# Altium schematic sheet MCU.SchDoc
size B
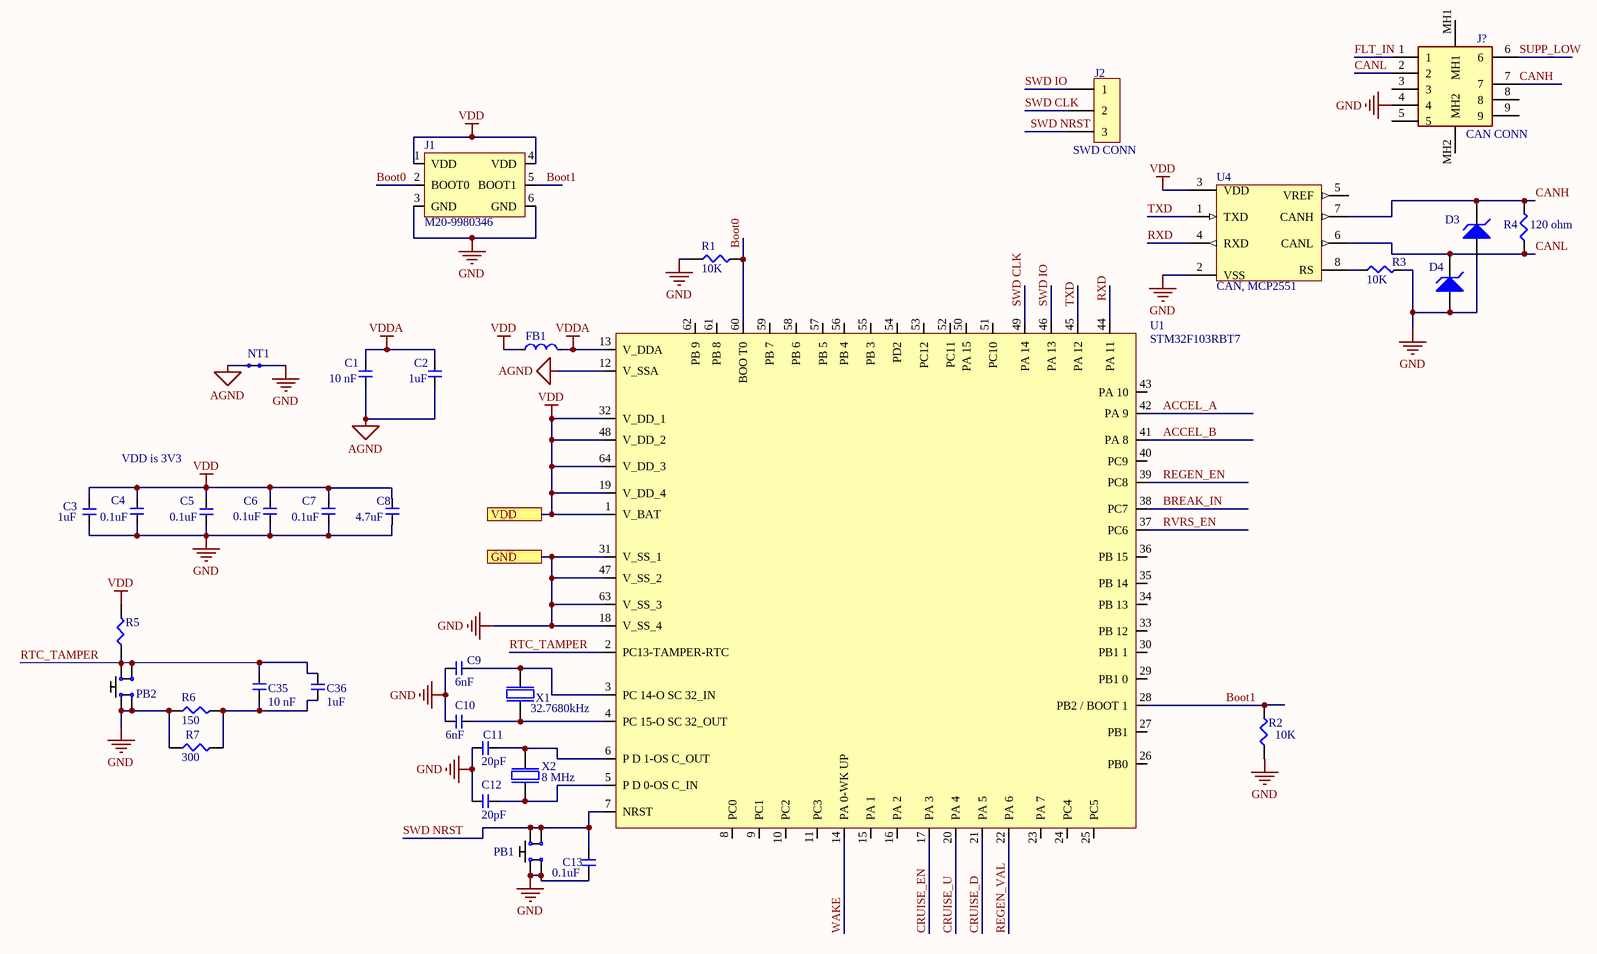
[diagram p0: MCU.SchDoc]

## Parts
C1  10 nF  [C0805]
C2  1uF  [C0805]
C3  1uF  [C0805]
C4  0.1uF  [C0805]
C5  0.1uF  [C0805]
C6  0.1uF  [C0805]
C7  0.1uF  [C0805]
C8  4.7uF  [C0805]
C9  6nF  [C0805]
C10  6nF  [C0805]
C11  20pF  [C0805]
C12  20pF  [C0805]
C13  0.1uF  [C0805]
C35  10 nF  [C0805]
C36  1uF  [C0805]
D3  TVS Diode 5V  [SOD-323]  (value not drawn)
D4  TVS Diode 5V  [SOD-323]  (value not drawn)
FB1  LF1206E152R-10  [L1206]  (value not drawn)
J1  M20-9980346  [M20-9980346]
J2  1x3 HDR100  [MOLEX 0901200763]  (value not drawn)
J?  CAN CONN  [609-1486-ND]
NT1  NET TIE  [NETTIE]  (value not drawn)
PB1  P12961SCT-ND  [P12961SCT-ND]  (value not drawn)
PB2  P12961SCT-ND  [P12961SCT-ND]  (value not drawn)
R1  10K  [R0805]
R2  10K  [R0805]
R3  10K  [R0805]
R4  120 ohm  [L0805]
R5  RC0402JR-074K7L  [R0805]  (value not drawn)
R6  150  [R0805]
R7  300  [R0805]
U1  STM32F103RBT7  [stm32f103rb]
U4  CAN, MCP2551  [LT1677IS8#TRPBF]
X1  32.7680kHz  [MC-306 32.7680K-E5]
X2  8 MHz  [MA-406 8.0000M-G3]

## Ports
GND, VDD

## Nets
AGND: C1.2 C2.1 NT1.0 U1.12(V_SSA)
GND: C3.2 C4.1 C5.2 C6.2 C7.2 C8.1 C9.1 C10.1 C11.1 C12.1 C13.2 D3.1(A) D4.1(A) J1.3(GND) J1.6(GND) J?.4 NT1.1 PB1.1(A) PB1.3(B) PB2.1(A) PB2.3(B) R1.1 R2.1 R3.2 R6.1 R7.1 U1.18(V_SS_4) U1.31(V_SS_1) U1.47(V_SS_2) U1.63(V_SS_3) U4.2(VSS) ; port GND
VDD: C3.1 C4.2 C5.1 C6.1 C7.1 C8.2 FB1.1 J1.1(VDD) J1.4(VDD) R5.2 U1.1(V_BAT) U1.19(V_DD_4) U1.32(V_DD_1) U1.48(V_DD_2) U1.64(V_DD_3) U4.3(VDD) ; port VDD
VDDA: C1.1 C2.2 FB1.2 U1.13(V_DDA)
ACCEL_A: U1.42(PA_9)
ACCEL_B: U1.41(PA_8)
Boot0: J1.2(BOOT0) R1.2 U1.60(BOO_T0)
Boot1: J1.5(BOOT1) R2.2 U1.28(PB2_/_BOOT_1)
BREAK_IN: U1.38(PC7)
CANH: D3.2(K) J?.7 R4.2 U4.7(CANH)
CANL: D4.2(K) J?.2 R4.1 U4.6(CANL)
CRUISE_D: U1.21(PA_5)
CRUISE_EN: U1.17(PA_3)
CRUISE_U: U1.20(PA_4)
FLT_IN: J?.1
REGEN_EN: U1.39(PC8)
REGEN_VAL: U1.22(PA_6)
RTC_TAMPER: C35.2 C36.2 PB2.2(A') PB2.4(B') R5.1 U1.2(PC13-TAMPER-RTC)
RVRS_EN: U1.37(PC6)
RXD: U1.44(PA_11) U4.4(RXD)
SUPP_LOW: J?.6
SWD CLK: J2.2 U1.49(PA_14)
SWD IO: J2.1 U1.46(PA_13)
SWD NRST: C13.1 J2.3 PB1.2(A') PB1.4(B') U1.7(NRST)
TXD: U1.45(PA_12) U4.1(TXD)
WAKE: U1.14(PA_0-WK_UP)
NetC9_2: C9.2 U1.3(PC_14-O_SC_32_IN) X1.4
NetC10_2: C10.2 U1.4(PC_15-O_SC_32_OUT) X1.1
NetC11_2: C11.2 U1.6(P_D_1-OS_C_OUT) X2.1
NetC12_2: C12.2 U1.5(P_D_0-OS_C_IN) X2.4
NetC35_1: C35.1 C36.1 R6.2 R7.2
NetR3_1: R3.1 U4.8(RS)

Not connected (* = marked no-connect by the designer): J? 3 5 8 9 MH1 MH2; U1 8(PC0) 9(PC1) 10(PC2) 11(PC3) 15(PA_1) 16(PA_2) 23(PA_7) 24(PC4) 25(PC5) 26(PB0) 27(PB1) 29(PB1_0) 30(PB1_1) 33(PB_12) 34(PB_13) 35(PB_14) 36(PB_15) 40(PC9) 43(PA_10) 50(PA_15) 51(PC10) 52(PC11) 53(PC12) 54(PD2) 55(PB_3) 56(PB_4) 57(PB_5) 58(PB_6) 59(PB_7) 61(PB_8) 62(PB_9); U4 5(VREF)

## Notes on the sheet
- (near J2) SWD CONN
- VDD is 3V3

## Library data of the parts
C1 C35 = 399-17617-2-ND: CAP CER .01UF 100V X7R SMD 0805; Manufacturer 1: KEMET; Manufacturer Part Number 1: C0805C103K1RAC7210; Dielectric Material: Ceramic; Tolerance: 10%; Capacitance: 10nF; Supplier 1: Digi-Key; Stock 1: 57741; Pricing 1: 1=0.10000, 10=0.06800, 100=0.03040, 500=0.02172, 1000=0.01706, 2500=0.01551, 5000=0.01427 (USD); RoHS: Yes; Mount: Surface Mount; Case/Package: 0805; Case Code (Imperial): 0805; Case Code (Metric): 2012; Min Operating Temperature: -55°C; Max Operating Temperature: 125°C; Packaging: Tape and Reel; Package Quantity: 10000; Voltage Rating: 100V; Voltage Rating (DC): 100V; Dielectric: X7R; Termination: SMD/SMT; Length: 2mm; Height: 0.78mm; Depth: 1.25mm; Radiation Hardening: No; ComponentLink1URL: http://components.arrow.com/part/dataview/0323_00324583?src-supplier=Arrow+Europe; ComponentLink1Description: http://components.arrow.com/part/dataview/0323_00324583?src-supplier=Arrow+Europe; ComponentLink2URL: http://www.mouser.com/ds/2/212/KEM_C1002_X7R_SMD-1102033.pdf?src-supplier=Mouser; ComponentLink2Description: http://www.mouser.com/ds/2/212/KEM_C1002_X7R_SMD-1102033.pdf?src-supplier=Mouser; ComponentLink3URL: http://components.arrow.com/part/dataview/2091052S6675795N7429?src-supplier=Arrow; ComponentLink3Description: http://components.arrow.com/part/dataview/2091052S6675795N7429?src-supplier=Arrow; ComponentLink4URL: https://www.verical.com/server-webapp/html/getDatasheet?partID=131027&src-supplier=Verical; ComponentLink4Description: https://www.verical.com/server-webapp/html/getDatasheet?partID=131027&src-supplier=Verical; ComponentLink5URL: http://www.kemet.com/kemet/web/homepage/kechome.nsf/weben/C4DA2DA1D1C9D3C3CA2570A50016092D/$file/KEM_C1002_X7R_SMD.pdf?src-supplier=Avnet+Europe; ComponentLink5Description: http://www.kemet.com/kemet/web/homepage/kechome.nsf/weben/C4DA2DA1D1C9D3C3CA2570A50016092D/$file/KEM_C1002_X7R_SMD.pdf?src-supplier=Avnet+Europe; ComponentLink6URL: http://www.kemet.com/kemet/web/homepage/kechome.nsf/weben/C4DA2DA1D1C9D3C3CA2570A50016092D/$file/KEM_C1002_X7R_SMD.pdf?src-supplier=Avnet; ComponentLink6Description: http://www.kemet.com/kemet/web/homepage/kechome.nsf/weben/C4DA2DA1D1C9D3C3CA2570A50016092D/$file/KEM_C1002_X7R_SMD.pdf?src-supplier=Avnet; ComponentLink7URL: https://api.kemet.com/component-edge/download/datasheet/C0805C103K1RAC7210.pdf?src-supplier=Digi-Key; ComponentLink7Description: https://api.kemet.com/component-edge/download/datasheet/C0805C103K1RAC7210.pdf?src-supplier=Digi-Key; Supplier Part Number 1: 399-17617-1-ND
C2 C3 C36 = CL21B105KAFNNNE: Cap Ceramic 1uF 25V X7R 10% SMD 0805 125C T/R; Manufacturer: Samsung; Supplier 1: Digi-Key; Supplier Part Number 1: 1276-1066-1-ND; Manufacturer Part Number: CL21B105KAFNNNE; Stock 1: 1606570; Pricing 1: 1 = 0.10000, 10 = 0.07600, 100 = 0.03380, 500 = 0.02416, 1000 = 0.01898 (USD); RoHS: Yes; Mount: Surface Mount; Case/Package: 0805; Contact Plating: Tin; Case Code (Metric): 2012; Case Code (Imperial): 0805; Min Operating Temperature: -55°C; Max Operating Temperature: 125°C; Packaging: Tape and Reel; Package Quantity: 1; Capacitance: 1uF; Tolerance: 10%; Voltage Rating: 25V; Dielectric: X7R; Voltage: 25V; Voltage Rating (DC): 25V; Length: 2mm; Height: 1.25mm; Depth: 1.25mm; Width: 0.049inch; Thickness: 0.053inch; Radiation Hardening: No; Lead Free: Lead Free; ComponentLink1URL: https://datasheet.ciiva.com/25800/cl21b105kafnnne-25800163.pdf?src-supplier=Digi-Key; ComponentLink1Description: https://datasheet.ciiva.com/25800/cl21b105kafnnne-25800163.pdf?src-supplier=Digi-Key; ComponentLink2URL: https://datasheet.ciiva.com/15195/getdatasheetpartid-355205-15195880.pdf?src-supplier=Verical; ComponentLink2Description: https://datasheet.ciiva.com/15195/getdatasheetpartid-355205-15195880.pdf?src-supplier=Verical; Category: Capacitors
C4-C7 C13 = CL21B104KBCWPNC: CAP CER 0.1UF 50V X7R 0805; Manufacturer: Samsung; Capacitance: 100nF; Tolerance: 10%; Supplier 1: Digi-Key; Supplier Part Number 1: 1276-6557-1-ND; Manufacturer Part Number: CL21B104KBCWPNC; Stock 1: 6545; Pricing 1: 1 = 0.10000, 10 = 0.06700, 100 = 0.02990, 500 = 0.02138, 1000 = 0.01680 (USD); RoHS: Yes; Mount: Surface Mount; Case/Package: 0805; Case Code (Metric): 2012; Case Code (Imperial): 0805; Min Operating Temperature: -55°C; Max Operating Temperature: 125°C; Packaging: Tape and Reel; Voltage Rating: 50V; Features: Soft Termination; Length: 0.079inch; Width: 0.049inch; Thickness: 0.053inch; Ratings: AEC-Q200; Category: Capacitors
C8 = 311-1371-2-ND: CAP CER 4.7UF 10V Y5V 0805; Manufacturer 1: Yageo; Manufacturer Part Number 1: CC0805ZRY5V6BB475; Tolerance: 80%; Supplier 1: Digi-Key; Stock 1: 117585; Pricing 1: 1=0.19000, 10=0.13200, 100=0.06670, 500=0.04564, 1000=0.04037 (USD); RoHS: Yes; Mount: Surface Mount; Case/Package: 0805; Number of Pins: 2; Case Code (Metric): 2012; Case Code (Imperial): 0805; Min Operating Temperature: -30°C; Max Operating Temperature: 85°C; Package Quantity: 1; Capacitance: 4.7uF; Voltage Rating: 10V; Packaging: Tape and Reel; Voltage Rating (DC): 10V; Dielectric: Y5V; Termination: SMD/SMT; Composition: Ceramic; Length: 2mm; Height: 0.85mm; Width: 0.049inch; Thickness: 0.033inch; Depth: 1.25mm; Radiation Hardening: No; REACH SVHC: Unknown; Lead Free: Lead Free; Halogen Free: Halogen Free; ComponentLink1URL: https://datasheet.ciiva.com/26863/getdatasheetpartid-251807-26863009.pdf?src-supplier=Verical; ComponentLink1Description: https://datasheet.ciiva.com/26863/getdatasheetpartid-251807-26863009.pdf?src-supplier=Verical; ComponentLink2URL: https://datasheet.ciiva.com/144/mlccorderingcode-144864.pdf?src-supplier=Digi-Key; ComponentLink2Description: https://datasheet.ciiva.com/144/mlccorderingcode-144864.pdf?src-supplier=Digi-Key; ComponentLink3URL: https://datasheet.ciiva.com/144/mlccorderingcode-144865.pdf?src-supplier=Digi-Key; ComponentLink3Description: https://datasheet.ciiva.com/144/mlccorderingcode-144865.pdf?src-supplier=Digi-Key; ComponentLink4URL: https://datasheet.ciiva.com/11465/upy-gphc-y5v-6-3v-to-50v-5-11465845.pdf?src-supplier=Avnet; ComponentLink4Description: https://datasheet.ciiva.com/11465/upy-gphc-y5v-6-3v-to-50v-5-11465845.pdf?src-supplier=Avnet; ComponentLink5URL: https://datasheet.ciiva.com/16624/upy-gphc-y5v-6-3v-to-50v-5-16624679.pdf?src-supplier=Avnet+Europe; ComponentLink5Description: https://datasheet.ciiva.com/16624/upy-gphc-y5v-6-3v-to-50v-5-16624679.pdf?src-supplier=Avnet+Europe; ComponentLink6URL: https://datasheet.ciiva.com/28450/1132289-28450855.pdf?src-supplier=Element14; ComponentLink6Description: https://datasheet.ciiva.com/28450/1132289-28450855.pdf?src-supplier=Element14; ComponentLink7URL: https://datasheet.ciiva.com/7978/1132289-7978222.pdf?src-supplier=Element14; ComponentLink7Description: https://datasheet.ciiva.com/7978/1132289-7978222.pdf?src-supplier=Element14; ComponentLink8URL: https://datasheet.ciiva.com/144/mlccorderingcode-144863.pdf?src-supplier=Digi-Key; ComponentLink8Description: https://datasheet.ciiva.com/144/mlccorderingcode-144863.pdf?src-supplier=Digi-Key; ComponentLink9URL: https://datasheet.ciiva.com/5425/upy-gp-np0-16v-to-50v-8-5425455.pdf?src-supplier=Mouser; ComponentLink9Description: https://datasheet.ciiva.com/5425/upy-gp-np0-16v-to-50v-8-5425455.pdf?src-supplier=Mouser; ComponentLink10URL: https://datasheet.ciiva.com/17004/upy-gphc-y5v-6-3v-to-50v-5-revised-17004479.pdf?src-supplier=Future+Electronics; ComponentLink10Description: https://datasheet.ciiva.com/17004/upy-gphc-y5v-6-3v-to-50v-5-revised-17004479.pdf?src-supplier=Future+Electronics; Supplier Part Number 1: 311-1371-1-ND
C9 C10 = 478-10411-2-ND: CAP CER 6PF 100V C0G/NP0 0805; Capacitance: 9pF; Dielectric: C0G; Supplier 1: Digi-Key; RoHS: Yes; Mount: Surface Mount; Case/Package: 0805; Weight: 0.000194oz; Case Code (Imperial): 0805; Case Code (Metric): 2012; Min Operating Temperature: -55°C; Max Operating Temperature: 125°C; Packaging: Tape and Reel; Package Quantity: 4000; Voltage Rating: 100V; Voltage Rating (DC): 100V; Termination: SMD/SMT; Length: 2.01mm; Width: 1.25mm; Thickness: 0.037inch; Depth: 1.25mm; Radiation Hardening: No; Supplier Part Number 1: 478-10411-2-ND; ComponentLink1Description: https://www.digikey.com/product-detail/en/avx-corporation/08051A6R0CAT2A/478-10411-2-ND/1601219; ComponentLink1URL: https://www.digikey.com/product-detail/en/avx-corporation/08051A6R0CAT2A/478-10411-2-ND/1601219
C11 C12 = C0805C200J5GACTU: CAP CER 20PF 50V C0G/NP0 0805; Manufacturer: Samsung; Manufacturer Part Number: CL21B103KBANNNC; Material: Ceramic; Capacitance: 10nF; Tolerance: 10%; Dielectric: X7R; Supplier 1: Digi-Key; Supplier Part Number 1: 399-8033-1-ND; RoHS: Yes; Mount: Surface Mount; Case/Package: 0805; Case Code (Metric): 2012; Case Code (Imperial): 0805; Contact Plating: Tin; Min Operating Temperature: -55°C; Max Operating Temperature: 125°C; Packaging: Tape and Reel; Voltage Rating: 50V; Voltage: 50V; Voltage Rating (DC): 50V; Length: 2mm; Height: 0.65mm; Width: 0.049inch; Thickness: 0.03inch; Depth: 1.25mm; Radiation Hardening: No; Lead Free: Lead Free; Category: Capacitors; ComponentLink1Description: https://www.digikey.com/product-detail/en/kemet/C0805C200J5GACTU/399-8033-1-ND/3471756; ComponentLink1URL: https://www.digikey.com/product-detail/en/kemet/C0805C200J5GACTU/399-8033-1-ND/3471756
D3 D4 = SD05T1G: TVS DIODE 5V 9.8V SOD323; Manufacturer: ON Semiconductor; Capacitance: 350pF; Direction: Unidirectional; Clamping Voltage: 14.5V; Peak Pulse Power: 350W; Number of Unidirectional Channels: 1; Min Breakdown Voltage: 6.2V; Power Line Protection: No; Peak Pulse Current: 24A; Element Configuration: Single; Breakdown Voltage: 6.75V; Leakage Current: 10uA; Max Breakdown Voltage: 7.3V; Test Current: 1mA; ESD Protection: Yes; Max Power Dissipation: 200mW; Supplier 1: Digi-Key; Supplier Part Number 1: SD05T1GOSCT-ND; Manufacturer Part Number: SD05T1G; Stock 1: 61559; Pricing 1: 1 = 0.49000, 10 = 0.36500, 100 = 0.20680, 500 = 0.13698, 1000 = 0.10502 (USD); RoHS: Yes; Case/Package: SOD-323-2; Number of Pins: 2; Contact Plating: Tin; Min Operating Temperature: -55°C; Max Operating Temperature: 150°C; Packaging: Tape and Reel; Reverse Standoff Voltage: 5V; Working Voltage: 5V; Composition: Zener; Package Quantity: 1; Operating Supply Voltage: 5V; Max Surge Current: 24A; Number of Elements: 1; Reverse Breakdown Voltage: 6.2V; Polarity: Unidirectional; Termination: SMD/SMT; Power Dissipation: 350W; Max Reverse Leakage Current: 10uA; Voltage Rating (DC): 5V; Max Output Current: 24A; Length: 1.7mm; Height: 1mm; Width: 1.35mm; Depth: 1.25mm; Radiation Hardening: No; Lead Free: Lead Free; REACH SVHC: No SVHC; ComponentLink1URL: https://datasheet.ciiva.com/4507/sd05t1-d-241634-4507873.pdf?src-supplier=Mouser; ComponentLink1Description: https://datasheet.ciiva.com/4507/sd05t1-d-241634-4507873.pdf?src-supplier=Mouser; ComponentLink2URL: https://datasheet.ciiva.com/16200/sd05t1-d-16200994.pdf?src-supplier=Future+Electronics; ComponentLink2Description: https://datasheet.ciiva.com/16200/sd05t1-d-16200994.pdf?src-supplier=Future+Electronics; ComponentLink3URL: https://datasheet.ciiva.com/15143/getdatasheetpartid-117154-15143559.pdf?src-supplier=Verical; ComponentLink3Description: https://datasheet.ciiva.com/15143/getdatasheetpartid-117154-15143559.pdf?src-supplier=Verical; ComponentLink4URL: https://datasheet.ciiva.com/30478/0900766b81250bd7-30478714.pdf?src-supplier=RSComponents; ComponentLink4Description: https://datasheet.ciiva.com/30478/0900766b81250bd7-30478714.pdf?src-supplier=RSComponents; ComponentLink5URL: https://datasheet.ciiva.com/339/sd05t1-d-339830.pdf?src-supplier=Digi-Key; ComponentLink5Description: https://datasheet.ciiva.com/339/sd05t1-d-339830.pdf?src-supplier=Digi-Key; ComponentLink6URL: https://datasheet.ciiva.com/339/sd05t1-d-339831.pdf?src-supplier=Digi-Key; ComponentLink6Description: https://datasheet.ciiva.com/339/sd05t1-d-339831.pdf?src-supplier=Digi-Key; ComponentLink7URL: https://datasheet.ciiva.com/11193/sd05t1-d-11193467.pdf?src-supplier=Avnet; ComponentLink7Description: https://datasheet.ciiva.com/11193/sd05t1-d-11193467.pdf?src-supplier=Avnet; ComponentLink8URL: https://datasheet.ciiva.com/22637/1878253-22637228.pdf?src-supplier=Element14; ComponentLink8Description: https://datasheet.ciiva.com/22637/1878253-22637228.pdf?src-supplier=Element14; ComponentLink9URL: https://datasheet.ciiva.com/25956/sd05t1-d-25956638.pdf?src-supplier=Avnet+Europe; ComponentLink9Description: https://datasheet.ciiva.com/25956/sd05t1-d-25956638.pdf?src-supplier=Avnet+Europe; Category: Circuit Protection
FB1 = LF1206E152R-10: FERRITE BEAD 946 OHM 1206 1LN; Manufacturer 1: Laird; Impedance: 300mR; Current Rating: 500mA; Number of Lines: 1; Test Frequency: 100MHz; Resistance: 950R; Shielding: Unshielded; ComponentLink1Description: mouser; ComponentLink1URL: https://www.mouser.ca/ProductDetail/Laird-Performance-Materials/LF1206E152R-10?qs=sGAEpiMZZMtdyQheitOmRQJP4YNOTsGtF9de3w5p7BA%3D; Supplier 1: Digi-Key; Manufacturer Part Number 1: LF1206E152R-10; Stock 1: 31440; Pricing 1: 1=0.22000, 10=0.17900, 25=0.13960, 50=0.11560, 100=0.09960, 250=0.07972, 500=0.07174, 1000=0.05978 (USD); RoHS: Yes; Mount: Surface Mount; Case/Package: 1206; Case Code (Metric): 3216; Case Code (Imperial): 1206; Material: Ferrite; Min Operating Temperature: -40°C; Max Operating Temperature: 125°C; Package Quantity: 1; Packaging: Tape and Reel; Max Current Rating: 500mA; DC Resistance (DCR): 300mR; Max DC Current: 500mA; Termination: SMD/SMT; Length: 3.2mm; Height: 0.051inch; Width: 0.063inch; Depth: 1.8mm; Lead Free: Lead Free; ComponentLink2URL: https://datasheet.ciiva.com/8512/lf1206e152r-10-a-vp-8512625.pdf?src-supplier=Avnet; ComponentLink2Description: https://datasheet.ciiva.com/8512/lf1206e152r-10-a-vp-8512625.pdf?src-supplier=Avnet; ComponentLink3URL: https://datasheet.ciiva.com/1013/lf1206e152r-10-b-1013350.pdf?src-supplier=Digi-Key; ComponentLink3Description: https://datasheet.ciiva.com/1013/lf1206e152r-10-b-1013350.pdf?src-supplier=Digi-Key; Supplier Part Number 1: 240-2566-1-ND; ComponentLink4Description: https://www.digikey.com/product-detail/en/laird-signal-integrity-products/LF1206E152R-10/240-2566-1-ND/1236446; ComponentLink4URL: https://www.digikey.com/product-detail/en/laird-signal-integrity-products/LF1206E152R-10/240-2566-1-ND/1236446
J1 = M20-9980346: Header 2x3; Manufacturer 1: Harwin; Number of Contacts: 6; Contact Resistance: 25mR; Current Rating: 3A; Gender: Male; Insulation Resistance: 10GR; Connector Type: Male Pin; Pitch: 2.54mm; Row Spacing: 0.1inch; Supplier 1: Digi-Key; Manufacturer Part Number 1: M20-9980346; Stock 1: 16309; Pricing 1: 1=0.24000, 10=0.22900, 100=0.15860, 500=0.13420, 1000=0.10980, 5000=0.09760, 10000=0.08845 (USD); RoHS: Yes; Mount: Through Hole; Contact Plating: Tin; Color: Black; Contact Material: Bronze,Brass; Housing Color: Black; Housing Material: Nylon; Min Operating Temperature: -40°C; Max Operating Temperature: 105°C; Number of Rows: 2; Termination: Solder; Package Quantity: 1000; Packaging: Bag; Max Current Rating: 3A; Number of Positions: 6; Orientation: Straight; Length: 7.62mm; Contact Mating Length: 0.24inch; Depth: 5.08mm; Radiation Hardening: No; REACH SVHC: No SVHC; ComponentLink1URL: https://datasheet.ciiva.com/11745/0900766b81034e61-11745752.pdf?src-supplier=RSComponents; ComponentLink1Description: https://datasheet.ciiva.com/11745/0900766b81034e61-11745752.pdf?src-supplier=RSComponents; ComponentLink2URL: https://datasheet.ciiva.com/26899/getdatasheetpartid-483857-26899433.pdf?src-supplier=Verical; ComponentLink2Description: https://datasheet.ciiva.com/26899/getdatasheetpartid-483857-26899433.pdf?src-supplier=Verical; ComponentLink3URL: https://datasheet.ciiva.com/8046/112195-8046906.pdf?src-supplier=Element14; ComponentLink3Description: https://datasheet.ciiva.com/8046/112195-8046906.pdf?src-supplier=Element14; Supplier Part Number 1: 952-2121-ND
J2 = 0901200763: CONN HEADER VERT 3POS 2.54MM; Manufacturer: Molex; Manufacturer Part Number: 90120-0763; Number of Positions: 3; Gender: Male; Contact Resistance: 20mR; Max Voltage Rating (DC): 350.35kV; Current Rating: 3A; Voltage Rating (AC): 350V; Insulation Resistance: 5GR; Number of Circuits: 2; Glow Wire Compliant: Non-compliant; Supplier 1: Digi-Key; Supplier Part Number 1: WM8085-ND; Stock 1: 17038; Pricing 1: 1 = 0.90000, 10 = 0.79100, 100 = 0.68200, 500 = 0.55800, 1000 = 0.49600, 5000 = 0.43400, 10000 = 0.41230 (USD); RoHS: Yes; Mount: Through Hole; Color: Black; Housing Color: Black; Housing Material: Polyester; Contact Plating: Tin; Contact Material: Brass; Material: Glass; Min Operating Temperature: -55°C; Max Operating Temperature: 125°C; Number of Rows: 1; Packaging: Tray; Termination: Solder; Orientation: Straight; Number of Contacts: 3; Package Quantity: 3000; Number of Poles: 3; Voltage Rating: 350V; Working Voltage: 350V; Voltage Rating (DC): 350V; Pitch: 2.54mm; Lead Pitch: 2.54mm; Radiation Hardening: No; REACH SVHC: Unknown; Lead Free: Lead Free; Flammability Rating: UL94 V-2; Halogen Free: Not Halogen Free; ComponentLink1URL: https://datasheet.ciiva.com/30177/19330901200763-pcb-headers-30177538.pdf?src-supplier=Onlinecomponents.com; ComponentLink1Description: https://datasheet.ciiva.com/30177/19330901200763-pcb-headers-30177538.pdf?src-supplier=Onlinecomponents.com; ComponentLink2URL: https://datasheet.ciiva.com/11747/0900766b8002f268-11747896.pdf?src-supplier=RSComponents; ComponentLink2Description: https://datasheet.ciiva.com/11747/0900766b8002f268-11747896.pdf?src-supplier=RSComponents; ComponentLink3URL: https://datasheet.ciiva.com/5150/0901200763-pcb-headers-230143-5150559.pdf?src-supplier=Mouser; ComponentLink3Description: https://datasheet.ciiva.com/5150/0901200763-pcb-headers-230143-5150559.pdf?src-supplier=Mouser; Category: Connectors
J? = 609-1486-ND: D-SUB CONN 9 POS R/A; Manufacturer 1: Amphenol FCI; Manufacturer Part Number 1: D09S33E4GV00LF; Body Material: Metal; Plating: Tin,Bright; Connector Type: D-Sub,Receptacle,Signal; Number of Positions: 9; Max Voltage Rating (AC): 300V; Gender: Female; Current Rating: 5A; Number of Ports: 1; Mating Cycles: 200; Pitch: 2.84mm; Supplier 1: Digi-Key; Stock 1: 2084; Pricing 1: 1=1.78000, 10=1.61200, 25=1.51280, 50=1.44720, 100=1.38140, 250=1.24984, 500=1.15116, 1000=0.98670, 2500=0.92092 (USD); RoHS: Yes; Mount: Through Hole; Case/Package: Metal; Contact Material: Copper Alloy; Contact Plating: Gold,Tin,Matte; Housing Material: PBT; Housing Color: Black; Number of Terminals: 9; Color: Black; Min Operating Temperature: -55°C; Max Operating Temperature: 125°C; Termination: Solder; Number of Contacts: 9; Orientation: Right Angle; Number of Rows: 2; Packaging: Tray; Max Supply Voltage (AC): 300V; Package Quantity: 30; Voltage Rating: 300V; Contact Gender: Female; Length: 30.81mm; Depth: 18.77mm; Width: 12.55mm; Radiation Hardening: No; Flammability Rating: UL94 V-0; Lead Free: Lead Free; REACH SVHC: No SVHC; ComponentLink1URL: https://datasheet.ciiva.com/15177/getdatasheetpartid-234594-15177925.pdf?src-supplier=Verical; ComponentLink1Description: https://datasheet.ciiva.com/15177/getdatasheetpartid-234594-15177925.pdf?src-supplier=Verical; ComponentLink2URL: https://datasheet.ciiva.com/6799/c01-8646-0147-6799856.pdf?src-supplier=Newark; ComponentLink2Description: https://datasheet.ciiva.com/6799/c01-8646-0147-6799856.pdf?src-supplier=Newark; ComponentLink3URL: https://datasheet.ciiva.com/3106/c01-8646-0824-3106806.pdf?src-supplier=Avnet; ComponentLink3Description: https://datasheet.ciiva.com/3106/c01-8646-0824-3106806.pdf?src-supplier=Avnet; ComponentLink4URL: https://datasheet.ciiva.com/19472/1852694-19472166.pdf?src-supplier=Jameco; ComponentLink4Description: https://datasheet.ciiva.com/19472/1852694-19472166.pdf?src-supplier=Jameco; ComponentLink5URL: https://datasheet.ciiva.com/16662/c01-8646-0824-16662475.pdf?src-supplier=Avnet+Europe; ComponentLink5Description: https://datasheet.ciiva.com/16662/c01-8646-0824-16662475.pdf?src-supplier=Avnet+Europe; ComponentLink6URL: https://datasheet.ciiva.com/16915/70236921-16915261.pdf?src-supplier=Allied+Electronics; ComponentLink6Description: https://datasheet.ciiva.com/16915/70236921-16915261.pdf?src-supplier=Allied+Electronics; ComponentLink7URL: https://datasheet.ciiva.com/652/c01-8646-0147-652494.pdf?src-supplier=Digi-Key; ComponentLink7Description: https://datasheet.ciiva.com/652/c01-8646-0147-652494.pdf?src-supplier=Digi-Key; ComponentLink8URL: https://datasheet.ciiva.com/1426/c01-8646-0147-1426875.pdf?src-supplier=Element14; ComponentLink8Description: https://datasheet.ciiva.com/1426/c01-8646-0147-1426875.pdf?src-supplier=Element14; Supplier Part Number 1: 609-1486-ND
NT1 = NET TIE: NetTie
PB1 PB2 = P12961SCT-ND: SWITCH TACTILE SPST-NO 0.02A 15V; Manufacturer 1: Panasonic; Manufacturer Part Number 1: EVQ-Q2Y03W; Mechanical Life: 100000Cycles; Operating Force: 3.5N; Contact Current Rating: 20mA; Contact Resistance: 100mR; Number of Poles: 1; Voltage Rating (AC): 250V; Throw Configuration: SPST; Illumination Type: Non-Illuminated,Illuminated; Switch Travel: 0.25mm; Switch Function: Off-Mom; Actuator Type: Standard; Actuator Length: 1.3mm; Supplier 1: Digi-Key; Stock 1: 209620; Pricing 1: 1=0.30000, 10=0.28600, 25=0.27520, 50=0.26520, 100=0.25490, 250=0.23452, 500=0.20394, 1000=0.17335 (USD); RoHS: Yes; Mount: Surface Mount; Case/Package: SMD/SMT; Color: White; Min Operating Temperature: -40°C; Max Operating Temperature: 85°C; Current Rating: 20mA; Voltage Rating (DC): 15V; Packaging: Tape and Reel; Package Quantity: 1; Max Current Rating: 20mA; Max Voltage Rating (DC): 15V; Termination: SMD/SMT; Electrical Life: 100000Cycles; Orientation: Straight; Length: 6mm; Height: 3.1mm; Width: 6mm; Depth: 6.6mm; Thickness: 1.8mm; Radiation Hardening: No; REACH SVHC: Unknown; Lead Free: Lead Free; ComponentLink1URL: https://datasheet.ciiva.com/25603/0900766b810ad3e5-25603840.pdf?src-supplier=RSComponents; ComponentLink1Description: https://datasheet.ciiva.com/25603/0900766b810ad3e5-25603840.pdf?src-supplier=RSComponents; ComponentLink2URL: https://datasheet.ciiva.com/2901/atk0000ce28-2901284.pdf?src-supplier=Digi-Key; ComponentLink2Description: https://datasheet.ciiva.com/2901/atk0000ce28-2901284.pdf?src-supplier=Digi-Key; ComponentLink3URL: https://datasheet.ciiva.com/2901/atk0000ce28-2901285.pdf?src-supplier=Digi-Key; ComponentLink3Description: https://datasheet.ciiva.com/2901/atk0000ce28-2901285.pdf?src-supplier=Digi-Key; ComponentLink4URL: https://datasheet.ciiva.com/2901/atk0000ce28-2901286.pdf?src-supplier=Digi-Key; ComponentLink4Description: https://datasheet.ciiva.com/2901/atk0000ce28-2901286.pdf?src-supplier=Digi-Key; ComponentLink5URL: https://datasheet.ciiva.com/30127/8atk0000ce28-30127814.pdf?src-supplier=Onlinecomponents.com; ComponentLink5Description: https://datasheet.ciiva.com/30127/8atk0000ce28-30127814.pdf?src-supplier=Onlinecomponents.com; ComponentLink6URL: https://datasheet.ciiva.com/8165/atk0000ce28-8165191.pdf?src-supplier=Avnet; ComponentLink6Description: https://datasheet.ciiva.com/8165/atk0000ce28-8165191.pdf?src-supplier=Avnet; ComponentLink7URL: https://datasheet.ciiva.com/17099/70270561-17099386.pdf?src-supplier=Allied+Electronics; ComponentLink7Description: https://datasheet.ciiva.com/17099/70270561-17099386.pdf?src-supplier=Allied+Electronics; ComponentLink8URL: https://datasheet.ciiva.com/5685/28111-5685339.pdf?src-supplier=Farnell; ComponentLink8Description: https://datasheet.ciiva.com/5685/28111-5685339.pdf?src-supplier=Farnell; ComponentLink9URL: https://datasheet.ciiva.com/16438/atk0000ce28-16438079.pdf?src-supplier=Future+Electronics; ComponentLink9Description: https://datasheet.ciiva.com/16438/atk0000ce28-16438079.pdf?src-supplier=Future+Electronics; Supplier Part Number 1: P12961SDKR-ND
R1-R3 = ERJ6ENF1002V: RES SMD 10K OHM 1% 1/8W 0805; Manufacturer: Yageo; Manufacturer Part Number: ERJ-6ENF1002V; Temperature Coefficient: 100ppm/°C; Voltage Rating (DC): 150V; Power Rating: 125mW; Resistance: 10000R; Supplier 1: Digi-Key; Supplier Part Number 1: P10.0KCCT-ND; Stock 1: 3342401; Pricing 1: 1 = 0.100000, 10 = 0.081000, 100 = 0.031100, 1000 = 0.013670, 2500 = 0.011810 (USD); RoHS: No; Mount: Surface Mount; Case/Package: 0805; Number of Pins: 2; Min Operating Temperature: -55°C; Max Operating Temperature: 155°C; Packaging: Tape and Reel; Tolerance: 1%; Length: 2mm; Height: 0.5mm; Depth: 1.25mm; Width: 1.25mm; REACH SVHC: No SVHC; Lead Free: Lead Free; ComponentLink1URL: https://datasheet.ciiva.com/27056/2078477-27056611.pdf?src-supplier=Jameco; ComponentLink1Description: https://datasheet.ciiva.com/27056/2078477-27056611.pdf?src-supplier=Jameco; Category: Resistors
R4 = ERJ6ENV1200V: RES SMD 120 OHM 1% 1/8W 0805; ComponentLink1Description: https://datasheet.ciiva.com/11821/0900766b80f80784-11821533.pdf?src-supplier=RSComponents; ComponentLink1URL: https://datasheet.ciiva.com/11821/0900766b80f80784-11821533.pdf?src-supplier=RSComponents; Supplier 1: Digi-Key; Supplier Part Number 1: P120CCT-ND
R5 = RC0402JR-074K7L: RES SMD 4.7K OHM 1% 1/8W 0805; Manufacturer 1: Yageo; Voltage Rating: 50V; Resistance: 4.7kR; Power Rating: 63mW; Tolerance: 5%; Temperature Coefficient: 100ppm/°C; Supplier 1: Digi-Key; Manufacturer Part Number 1: RC0402JR-074K7L; Stock 1: 19884749; Pricing 1: 1=0.10000, 10=0.01300, 100=0.00530, 1000=0.00236, 2500=0.00205, 5000=0.00169 (USD); RoHS: Yes; Case/Package: 0402; Case Code (Imperial): 0402; Case Code (Metric): 1005; Min Operating Temperature: -55°C; Max Operating Temperature: 155°C; Composition: Thick Film; Packaging: Tape and Reel; Package Quantity: 1; Termination: SMD/SMT; Number of Terminations: 2; Military Standard: Not; Max Power Dissipation: 63mW; Features: Moisture Resistant; Length: 0.039inch; Height: 0.016inch; Width: 0.02inch; Depth: 0.5mm; REACH SVHC: No SVHC; Lead Free: Lead Free; ComponentLink1URL: https://datasheet.ciiva.com/2452/pyu-r-int-thick-7-2452611.pdf?src-supplier=Digi-Key; ComponentLink1Description: https://datasheet.ciiva.com/2452/pyu-r-int-thick-7-2452611.pdf?src-supplier=Digi-Key; ComponentLink2URL: https://datasheet.ciiva.com/2452/pyu-r-int-thick-7-2452612.pdf?src-supplier=Digi-Key; ComponentLink2Description: https://datasheet.ciiva.com/2452/pyu-r-int-thick-7-2452612.pdf?src-supplier=Digi-Key; ComponentLink3URL: https://datasheet.ciiva.com/2452/pyu-r-int-thick-7-2452613.pdf?src-supplier=Digi-Key; ComponentLink3Description: https://datasheet.ciiva.com/2452/pyu-r-int-thick-7-2452613.pdf?src-supplier=Digi-Key; ComponentLink4URL: https://datasheet.ciiva.com/46412/1018594-46412841.pdf?src-supplier=Element14; ComponentLink4Description: https://datasheet.ciiva.com/46412/1018594-46412841.pdf?src-supplier=Element14; ComponentLink5URL: https://datasheet.ciiva.com/16800/pyu-rc0402-51-rohs-l-6-r-16800266.pdf?src-supplier=Future+Electronics; ComponentLink5Description: https://datasheet.ciiva.com/16800/pyu-rc0402-51-rohs-l-6-r-16800266.pdf?src-supplier=Future+Electronics; ComponentLink6URL: https://datasheet.ciiva.com/7850/1018594-7850222.pdf?src-supplier=Element14; ComponentLink6Description: https://datasheet.ciiva.com/7850/1018594-7850222.pdf?src-supplier=Element14; ComponentLink7URL: https://datasheet.ciiva.com/7850/1018594-7850223.pdf?src-supplier=Element14; ComponentLink7Description: https://datasheet.ciiva.com/7850/1018594-7850223.pdf?src-supplier=Element14; Supplier Part Number 1: 311-4.7KJRCT-ND
R6 = ERJ6ENF1500V: RES SMD 150 OHM 1% 1/8W 0805; Manufacturer: Panasonic; Voltage Rating: 150V; Resistance: 150R; Power Rating: 125mW; Temperature Coefficient: 100ppm/°C; Supplier 1: Digi-Key; Supplier Part Number 1: P150CCT-ND; Manufacturer Part Number: ERJ6ENF1500V; Stock 1: 287199; Pricing 1: 1 = 0.10000, 10 = 0.08100, 100 = 0.03110, 1000 = 0.01367, 2500 = 0.01181 (USD); RoHS: Yes; Mount: Surface Mount; Case/Package: 0805; Number of Pins: 2; Case Code (Metric): 2012; Case Code (Imperial): 0805; Contact Plating: Tin; Min Operating Temperature: -55°C; Max Operating Temperature: 155°C; Category: Resistors; Tolerance: 1%; Package Quantity: 1; Composition: Thick Film; Number of Terminations: 2; Military Standard: Not; Termination: SMD/SMT; Max Power Dissipation: 125mW; Voltage Rating (DC): 150V; Features: Automotive AEC-Q200; Working Voltage: 150V; Length: 2mm; Height: 0.6mm; Width: 0.049inch; Depth: 1.25mm; Radiation Hardening: No; REACH SVHC: No SVHC; Lead Free: Lead Free; ComponentLink1URL: https://datasheet.ciiva.com/11821/0900766b80f80784-11821520.pdf?src-supplier=RSComponents; ComponentLink1Description: https://datasheet.ciiva.com/11821/0900766b80f80784-11821520.pdf?src-supplier=RSComponents; ComponentLink2URL: https://datasheet.ciiva.com/7887/426256-7887029.pdf?src-supplier=Element14; ComponentLink2Description: https://datasheet.ciiva.com/7887/426256-7887029.pdf?src-supplier=Element14; ComponentLink3URL: https://datasheet.ciiva.com/16761/70260748-16761222.pdf?src-supplier=Allied+Electronics; ComponentLink3Description: https://datasheet.ciiva.com/16761/70260748-16761222.pdf?src-supplier=Allied+Electronics; ComponentLink4URL: https://datasheet.ciiva.com/46373/1678782-46373270.pdf?src-supplier=Element14; ComponentLink4Description: https://datasheet.ciiva.com/46373/1678782-46373270.pdf?src-supplier=Element14; ComponentLink5URL: https://datasheet.ciiva.com/46373/1678782-46373271.pdf?src-supplier=Element14; ComponentLink5Description: https://datasheet.ciiva.com/46373/1678782-46373271.pdf?src-supplier=Element14; ComponentLink6URL: https://datasheet.ciiva.com/30203/aoa0000ce2-30203641.pdf?src-supplier=Onlinecomponents.com; ComponentLink6Description: https://datasheet.ciiva.com/30203/aoa0000ce2-30203641.pdf?src-supplier=Onlinecomponents.com; ComponentLink7URL: https://datasheet.ciiva.com/9185/aoa0000ce2-9185514.pdf?src-supplier=Avnet; ComponentLink7Description: https://datasheet.ciiva.com/9185/aoa0000ce2-9185514.pdf?src-supplier=Avnet; Parameter 1: *
R7 = ERJ-6ENF3000V: RES SMD 300 OHM 1% 1/8W 0805; Manufacturer: Panasonic; Power Rating: 125mW; Voltage Rating: 150V; Resistance: 300R; Temperature Coefficient: 100ppm/°C; Supplier 1: Digi-Key; Supplier Part Number 1: P300CCT-ND; Manufacturer Part Number: ERJ-6ENF3000V; Stock 1: 271248; Pricing 1: 1 = 0.10000, 10 = 0.08100, 100 = 0.03110, 1000 = 0.01367, 2500 = 0.01181 (USD); RoHS: Yes; Mount: Surface Mount; Case/Package: 0805; Case Code (Imperial): 0805; Case Code (Metric): 2012; Contact Plating: Tin; Min Operating Temperature: -55°C; Max Operating Temperature: 155°C; Tolerance: 1%; Packaging: Tape and Reel; Package Quantity: 1; Composition: Thick Film; Number of Terminations: 2; Military Standard: Not; Max Power Dissipation: 125mW; Voltage Rating (DC): 150V; Features: Automotive AEC-Q200; Termination: SMD/SMT; Length: 2mm; Height: 0.028inch; Width: 1.2mm; Depth: 1.25mm; Radiation Hardening: No; REACH SVHC: No SVHC; Lead Free: Lead Free; ComponentLink1URL: https://datasheet.ciiva.com/7711/1678782-7711061.pdf?src-supplier=Element14; ComponentLink1Description: https://datasheet.ciiva.com/7711/1678782-7711061.pdf?src-supplier=Element14; ComponentLink2URL: https://datasheet.ciiva.com/9183/aoa0000ce2-9183350.pdf?src-supplier=Avnet; ComponentLink2Description: https://datasheet.ciiva.com/9183/aoa0000ce2-9183350.pdf?src-supplier=Avnet; ComponentLink3URL: https://datasheet.ciiva.com/30132/aoa0000ce2-30132023.pdf?src-supplier=Onlinecomponents.com; ComponentLink3Description: https://datasheet.ciiva.com/30132/aoa0000ce2-30132023.pdf?src-supplier=Onlinecomponents.com; ComponentLink4URL: https://datasheet.ciiva.com/17206/aoa0000ce2-17206376.pdf?src-supplier=Avnet+Europe; ComponentLink4Description: https://datasheet.ciiva.com/17206/aoa0000ce2-17206376.pdf?src-supplier=Avnet+Europe; ComponentLink5URL: https://datasheet.ciiva.com/16512/aoa0000ce2-16512233.pdf?src-supplier=Avnet+Asia; ComponentLink5Description: https://datasheet.ciiva.com/16512/aoa0000ce2-16512233.pdf?src-supplier=Avnet+Asia; ComponentLink6URL: https://datasheet.ciiva.com/22681/1678782-22681692.pdf?src-supplier=Element14; ComponentLink6Description: https://datasheet.ciiva.com/22681/1678782-22681692.pdf?src-supplier=Element14; ComponentLink7URL: https://datasheet.ciiva.com/46373/1678782-46373662.pdf?src-supplier=Element14; ComponentLink7Description: https://datasheet.ciiva.com/46373/1678782-46373662.pdf?src-supplier=Element14; ComponentLink8URL: https://datasheet.ciiva.com/46373/1678782-46373663.pdf?src-supplier=Element14; ComponentLink8Description: https://datasheet.ciiva.com/46373/1678782-46373663.pdf?src-supplier=Element14; Category: Resistors
U1 = STM32F103RBT7: MCU 32-bit STM32F1 ARM Cortex M3 RISC 128KB Flash 2.5V/3.3V 64-Pin LQFP Tray; Manufacturer 1: STMicroelectronics; Interface: I2C,SPI,USB,CAN,IrDA,UART,USART,LIN; Data Bus Width: 32b; RAM Size: 20KB; Max Power Dissipation: 444mW; Number of I/Os: 51; Number of Timers/Counters: 4; Frequency: 72MHz; Max Supply Voltage: 3.6V; Min Supply Voltage: 2V; Oscillator Type: Internal; Watchdog Timer: Yes; Peripherals: POR,PWM,WDT,DMA,Temp Sensor; Number of ADC Channels: 16; Number of SPI Channels: 2; Supplier 1: Digi-Key; Manufacturer Part Number 1: STM32F103RBT7; Stock 1: 1368; Pricing 1: 1=6.30000, 10=5.65500, 100=4.63300, 500=3.94400, 1000=3.32626 (USD); RoHS: Yes; Case/Package: LQFP; Number of Pins: 64; Min Operating Temperature: -40°C; Max Operating Temperature: 105°C; Core Architecture: ARM; Package Quantity: 160; Packaging: Tray; Number of Programmable I/O: 51; Max Frequency: 72MHz; Memory Type: FLASH; Memory Size: 128KB; Number of I2C Channels: 2; Length: 10mm; Height: 1.45mm; Width: 10mm; Radiation Hardening: No; REACH SVHC: No SVHC; ComponentLink1URL: https://media.digikey.com/pdf/Data%20Sheets/ST%20Microelectronics%20PDFS/STM32F103x8,B.pdf?src-supplier=Digi-Key; ComponentLink1Description: https://media.digikey.com/pdf/Data%20Sheets/ST%20Microelectronics%20PDFS/STM32F103x8,B.pdf?src-supplier=Digi-Key; ComponentLink2URL: http://www.mouser.com/ds/2/389/stm32f103c8-956229.pdf?src-supplier=Mouser; ComponentLink2Description: http://www.mouser.com/ds/2/389/stm32f103c8-956229.pdf?src-supplier=Mouser; ComponentLink3URL: http://www.farnell.com/datasheets/1963088.pdf?src-supplier=Farnell; ComponentLink3Description: http://www.farnell.com/datasheets/1963088.pdf?src-supplier=Farnell; ComponentLink4URL: http://uk.rs-online.com/webdocs/0ed0/0900766b80ed015c.pdf?src-supplier=RSComponents; ComponentLink4Description: http://uk.rs-online.com/webdocs/0ed0/0900766b80ed015c.pdf?src-supplier=RSComponents; ComponentLink5URL: http://components.arrow.com/part/dataview/0323_00214153?src-supplier=Arrow+Europe; ComponentLink5Description: http://components.arrow.com/part/dataview/0323_00214153?src-supplier=Arrow+Europe; ComponentLink6URL: http://www.produktinfo.conrad.com/datenblaetter/1000000-1099999/001075570-da-01-en-MCU_32BT_64K_STM32F103RBT7_LQFP_64_STM.pdf?src-supplier=Conrad; ComponentLink6Description: http://www.produktinfo.conrad.com/datenblaetter/1000000-1099999/001075570-da-01-en-MCU_32BT_64K_STM32F103RBT7_LQFP_64_STM.pdf?src-supplier=Conrad; ComponentLink7URL: http://www.farnell.com/datasheets/1963088.pdf?src-supplier=Newark; ComponentLink7Description: http://www.farnell.com/datasheets/1963088.pdf?src-supplier=Newark; ComponentLink8URL: http://www.st.com/web/en/resource/technical/document/datasheet/CD00161566.pdf?src-supplier=Element14; ComponentLink8Description: http://www.st.com/web/en/resource/technical/document/datasheet/CD00161566.pdf?src-supplier=Element14; ComponentLink9URL: http://www.st.com/internet/com/TECHNICAL_RESOURCES/TECHNICAL_LITERATURE/DATASHEET/CD00161566.pdf?src-supplier=Avnet; ComponentLink9Description: http://www.st.com/internet/com/TECHNICAL_RESOURCES/TECHNICAL_LITERATURE/DATASHEET/CD00161566.pdf?src-supplier=Avnet; ComponentLink10URL: http://components.arrow.com/part/dataview/45775055S8555844N7728?src-supplier=Arrow; ComponentLink10Description: http://components.arrow.com/part/dataview/45775055S8555844N7728?src-supplier=Arrow; Supplier Part Number 1: 497-11526-ND
U4 = MCP2551-E/SN: IC, TRANSCEIVER, CAN, SMD, 8SOIC; Manufacturer: Microchip; Interface: CAN,Serial; Operating Supply Voltage: 5V; Data Rate: 1Mbps; Max Supply Voltage: 5.5V; Min Supply Voltage: 4.5V; Nominal Supply Current: 75mA; Number of Receive Buffers: 1; Supplier 1: Digi-Key; Supplier Part Number 1: MCP2551-E/SN-ND; Manufacturer Part Number: MCP2551-E/SN; Stock 1: 9215; Pricing 1: 1 = 1.22000, 25 = 1.00960, 100 = 0.91670 (USD); RoHS: Yes; Mount: Surface Mount; Case/Package: SOIC; Number of Pins: 8; Contact Plating: Matte,Tin; Min Operating Temperature: -40°C; Max Operating Temperature: 125°C; Package Quantity: 100; Packaging: Rail/Tube; Number of Transmit Buffers: 1; Max Supply Current: 75mA; Number of Transceivers: 1; Number of Drivers: 1; Number of Receivers: 1; Logic Function: Transceiver; Length: 0.192inch; Height: 0.059inch; Width: 0.154inch; Radiation Hardening: No; REACH SVHC: No SVHC; Lead Free: Lead Free; ComponentLink1URL: http://www.microchip.com/mymicrochip/filehandler.aspx?ddocname=en011797&src-supplier=Future+Electronics; ComponentLink1Description: http://www.microchip.com/mymicrochip/filehandler.aspx?ddocname=en011797&src-supplier=Future+Electronics; ComponentLink2URL: http://www.microchip.com/mymicrochip/filehandler.aspx?ddocname=en023833&src-supplier=Digi-Key; ComponentLink2Description: http://www.microchip.com/mymicrochip/filehandler.aspx?ddocname=en023833&src-supplier=Digi-Key; ComponentLink3URL: http://www.mouser.com/ds/2/268/20001667G-1115479.pdf?src-supplier=Mouser; ComponentLink3Description: http://www.mouser.com/ds/2/268/20001667G-1115479.pdf?src-supplier=Mouser; ComponentLink4URL: https://www.distrelec.biz/Web/Downloads/_t/ds/mcp2551_eng_tds.pdf?mime=application%2Fpdf&src-supplier=Distrelec; ComponentLink4Description: https://www.distrelec.biz/Web/Downloads/_t/ds/mcp2551_eng_tds.pdf?mime=application%2Fpdf&src-supplier=Distrelec; ComponentLink5URL: http://www.farnell.com/datasheets/2299423.pdf?src-supplier=Element14; ComponentLink5Description: http://www.farnell.com/datasheets/2299423.pdf?src-supplier=Element14; Category: Integrated Circuits (ICs); ComponentLink6Description: Digikey; ComponentLink6URL: https://www.digikey.ca/product-detail/en/microchip-technology/MCP2551-E-SN/MCP2551-E-SN-ND/509446
X1 = MC-306 32.7680K-E5: CRYSTAL 32.7680 KHZ 6.0PF SMD; ESR (Equivalent Series Resistance): 65kR; Frequency: 32.768kHz; Load Capacitance: 9pF; Tolerance: 20ppm; Supplier 1: Digi-Key; RoHS: Yes; Mount: Surface Mount; Case/Package: SMD/SMT; Number of Pins: 4; Weight: 0.002116oz; Min Operating Temperature: -40°C; Max Operating Temperature: 85°C; Packaging: Tape and Reel; Package Quantity: 1000; Termination: SMD/SMT; Frequency Stability: 20ppm; Frequency Tolerance: 20ppm; Length: 6.7mm; Height: 0.055inch; Width: 0.06inch; Depth: 1.5mm; Supplier Part Number 1: MC-306 32.7680K-E5: ROHS-ND; ComponentLink1Description: https://www.digikey.com/product-detail/en/epson/MC-306-32.7680K-E5-ROHS/SER4099CT-ND/6132719; ComponentLink1URL: https://www.digikey.com/product-detail/en/epson/MC-306-32.7680K-E5-ROHS/SER4099CT-ND/6132719
X2 = MA-406 8.0000M-G3: CRYSTAL 8.00 MHZ 20.0 PF SMD; Frequency: 32.768kHz; Load Capacitance: 12.5pF; ESR (Equivalent Series Resistance): 65kR; Frequency Tolerance: 20ppm; Supplier 1: Digi-Key; RoHS: Yes; Mount: Surface Mount; Case/Package: SMD/SMT; Min Operating Temperature: -40°C; Max Operating Temperature: 85°C; Packaging: Tape and Reel; Length: 0.276inch; Height: 0.055inch; Width: 0.06inch; Supplier Part Number 1: SER4286CT-ND; ComponentLink1Description: https://www.digikey.ca/en/products/detail/epson/MA-406-8-0000M-G3-ROHS/5260050; ComponentLink1URL: https://www.digikey.ca/en/products/detail/epson/MA-406-8-0000M-G3-ROHS/5260050